# Altium schematic sheet input1.SchDoc
size A3
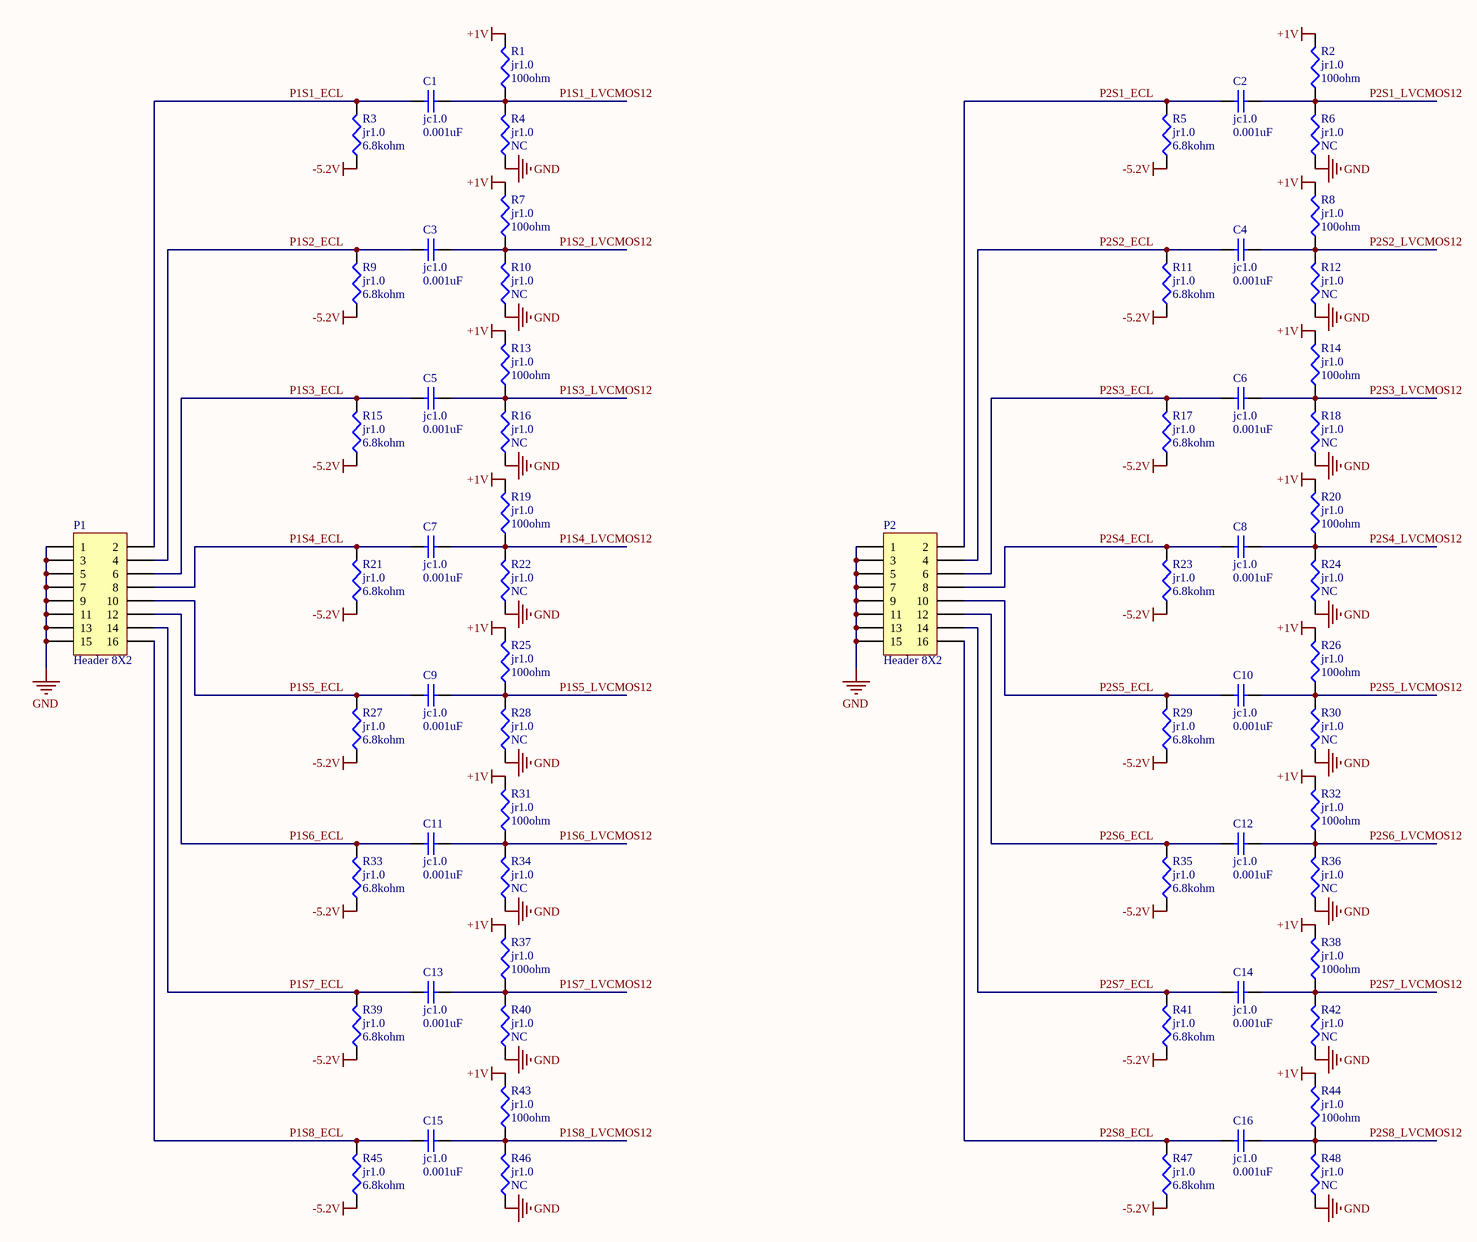
[diagram p0: input1.SchDoc]

## Parts
C1  jc1.0  value 0.001uF  [0402]
C2  jc1.0  value 0.001uF  [0402]
C3  jc1.0  value 0.001uF  [0402]
C4  jc1.0  value 0.001uF  [0402]
C5  jc1.0  value 0.001uF  [0402]
C6  jc1.0  value 0.001uF  [0402]
C7  jc1.0  value 0.001uF  [0402]
C8  jc1.0  value 0.001uF  [0402]
C9  jc1.0  value 0.001uF  [0402]
C10  jc1.0  value 0.001uF  [0402]
C11  jc1.0  value 0.001uF  [0402]
C12  jc1.0  value 0.001uF  [0402]
C13  jc1.0  value 0.001uF  [0402]
C14  jc1.0  value 0.001uF  [0402]
C15  jc1.0  value 0.001uF  [0402]
C16  jc1.0  value 0.001uF  [0402]
P1  Header 8X2  [HDR2X8]
P2  Header 8X2  [HDR2X8]
R1  jr1.0  value 100ohm  [0402]
R2  jr1.0  value 100ohm  [0402]
R3  jr1.0  value 6.8kohm  [0402]
R4  jr1.0  value NC  [0402]
R5  jr1.0  value 6.8kohm  [0402]
R6  jr1.0  value NC  [0402]
R7  jr1.0  value 100ohm  [0402]
R8  jr1.0  value 100ohm  [0402]
R9  jr1.0  value 6.8kohm  [0402]
R10  jr1.0  value NC  [0402]
R11  jr1.0  value 6.8kohm  [0402]
R12  jr1.0  value NC  [0402]
R13  jr1.0  value 100ohm  [0402]
R14  jr1.0  value 100ohm  [0402]
R15  jr1.0  value 6.8kohm  [0402]
R16  jr1.0  value NC  [0402]
R17  jr1.0  value 6.8kohm  [0402]
R18  jr1.0  value NC  [0402]
R19  jr1.0  value 100ohm  [0402]
R20  jr1.0  value 100ohm  [0402]
R21  jr1.0  value 6.8kohm  [0402]
R22  jr1.0  value NC  [0402]
R23  jr1.0  value 6.8kohm  [0402]
R24  jr1.0  value NC  [0402]
R25  jr1.0  value 100ohm  [0402]
R26  jr1.0  value 100ohm  [0402]
R27  jr1.0  value 6.8kohm  [0402]
R28  jr1.0  value NC  [0402]
R29  jr1.0  value 6.8kohm  [0402]
R30  jr1.0  value NC  [0402]
R31  jr1.0  value 100ohm  [0402]
R32  jr1.0  value 100ohm  [0402]
R33  jr1.0  value 6.8kohm  [0402]
R34  jr1.0  value NC  [0402]
R35  jr1.0  value 6.8kohm  [0402]
R36  jr1.0  value NC  [0402]
R37  jr1.0  value 100ohm  [0402]
R38  jr1.0  value 100ohm  [0402]
R39  jr1.0  value 6.8kohm  [0402]
R40  jr1.0  value NC  [0402]
R41  jr1.0  value 6.8kohm  [0402]
R42  jr1.0  value NC  [0402]
R43  jr1.0  value 100ohm  [0402]
R44  jr1.0  value 100ohm  [0402]
R45  jr1.0  value 6.8kohm  [0402]
R46  jr1.0  value NC  [0402]
R47  jr1.0  value 6.8kohm  [0402]
R48  jr1.0  value NC  [0402]

## Nets
+1V: R1.2 R2.2 R7.2 R8.2 R13.2 R14.2 R19.2 R20.2 R25.2 R26.2 R31.2 R32.2 R37.2 R38.2 R43.2 R44.2
-5.2V: R3.1 R5.1 R9.1 R11.1 R15.1 R17.1 R21.1 R23.1 R27.1 R29.1 R33.1 R35.1 R39.1 R41.1 R45.1 R47.1
GND: P1.1 P1.3 P1.5 P1.7 P1.9 P1.11 P1.13 P1.15 P2.1 P2.3 P2.5 P2.7 P2.9 P2.11 P2.13 P2.15 R4.1 R6.1 R10.1 R12.1 R16.1 R18.1 R22.1 R24.1 R28.1 R30.1 R34.1 R36.1 R40.1 R42.1 R46.1 R48.1
P1S1_ECL: C1.1 P1.2 R3.2
P1S1_LVCMOS12: C1.2 R1.1 R4.2
P1S2_ECL: C3.1 P1.4 R9.2
P1S2_LVCMOS12: C3.2 R7.1 R10.2
P1S3_ECL: C5.1 P1.6 R15.2
P1S3_LVCMOS12: C5.2 R13.1 R16.2
P1S4_ECL: C7.1 P1.8 R21.2
P1S4_LVCMOS12: C7.2 R19.1 R22.2
P1S5_ECL: C9.1 P1.10 R27.2
P1S5_LVCMOS12: C9.2 R25.1 R28.2
P1S6_ECL: C11.1 P1.12 R33.2
P1S6_LVCMOS12: C11.2 R31.1 R34.2
P1S7_ECL: C13.1 P1.14 R39.2
P1S7_LVCMOS12: C13.2 R37.1 R40.2
P1S8_ECL: C15.1 P1.16 R45.2
P1S8_LVCMOS12: C15.2 R43.1 R46.2
P2S1_ECL: C2.1 P2.2 R5.2
P2S1_LVCMOS12: C2.2 R2.1 R6.2
P2S2_ECL: C4.1 P2.4 R11.2
P2S2_LVCMOS12: C4.2 R8.1 R12.2
P2S3_ECL: C6.1 P2.6 R17.2
P2S3_LVCMOS12: C6.2 R14.1 R18.2
P2S4_ECL: C8.1 P2.8 R23.2
P2S4_LVCMOS12: C8.2 R20.1 R24.2
P2S5_ECL: C10.1 P2.10 R29.2
P2S5_LVCMOS12: C10.2 R26.1 R30.2
P2S6_ECL: C12.1 P2.12 R35.2
P2S6_LVCMOS12: C12.2 R32.1 R36.2
P2S7_ECL: C14.1 P2.14 R41.2
P2S7_LVCMOS12: C14.2 R38.1 R42.2
P2S8_ECL: C16.1 P2.16 R47.2
P2S8_LVCMOS12: C16.2 R44.1 R48.2

## Library data of the parts
C1-C16 = Cap: Capacitor; Published: 8-Jun-2000; LatestRevisionDate: 17-Jul-2002; LatestRevisionNote: Re-released for DXP Platform.; PackageReference: RAD-0.3; Publisher: Altium Limited
P1 P2 = Header 8X2: Header, 8-Pin, Dual row; LatestRevisionDate: 17-Jul-2002; LatestRevisionNote: Re-released for DXP Platform.; Publisher: Altium Limited
R1-R48 = Res: Resistor; Published: 8-Jun-2000; LatestRevisionDate: 04-Mar-2005; LatestRevisionNote: PCB Footprint replaced.; PackageReference: J1-0603; Publisher: Altium Limited